# Altium schematic sheet DRV8701ESheet.SchDoc
size 304 x 215 mm; SheetNumber: 1; SheetTotal: 1
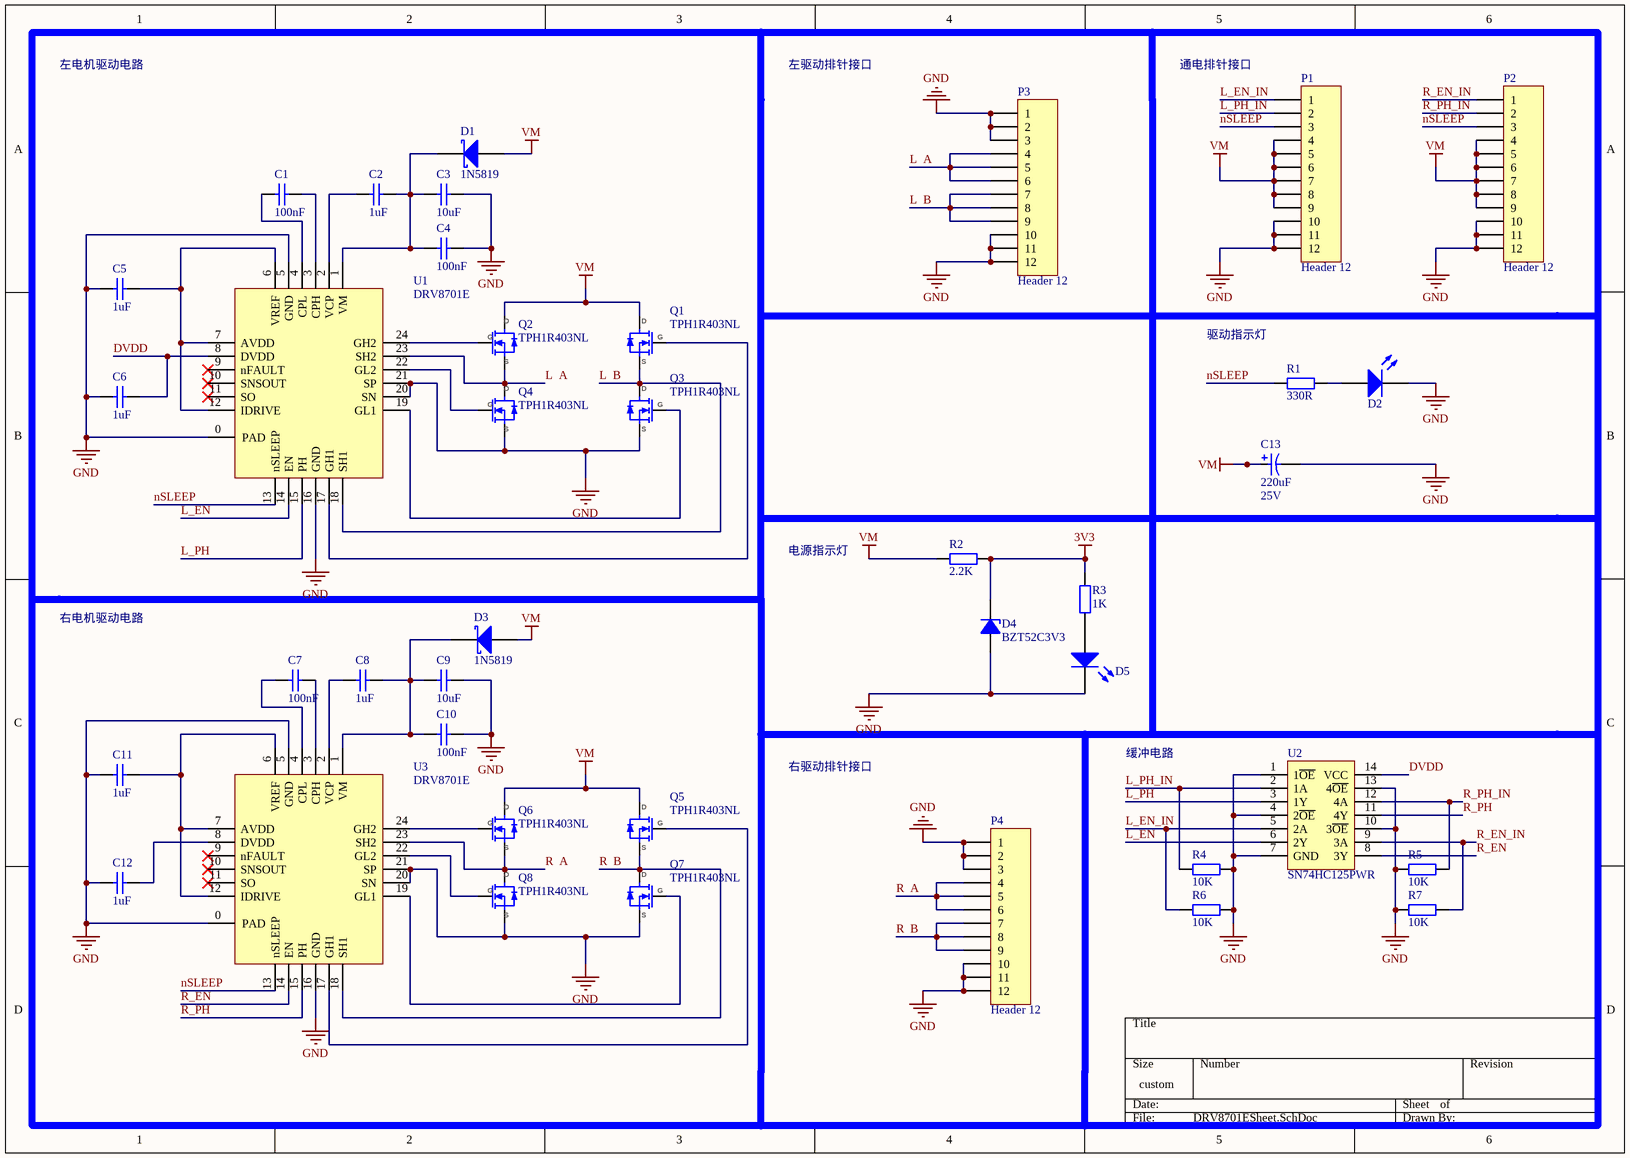
[diagram p0: DRV8701ESheet.SchDoc]

## Parts
C1  100nF  [C0603_L]
C2  1uF  [C0603_L]
C3  10uF  [C0603_L]
C4  100nF  [C0603_L]
C5  1uF  [C0603_L]
C6  1uF  [C0603_L]
C7  100nF  [C0603_L]
C8  1uF  [C0603_L]
C9  10uF  [C0603_L]
C10  100nF  [C0603_L]
C11  1uF  [C0603_L]
C12  1uF  [C0603_L]
C13  value 220uF  Voltage: 25V  [CAPPR3.5-8X11.5]  (hidden comment: 220uF 25V)
D1  1N5819  [SOD-323]
D2  LED  [LED-0603_R]  (value not drawn)
D3  1N5819  [SOD-323]
D4  BZT52C3V3  [SOD-123-L]
D5  LED  [LED-0603_R]  (value not drawn)
P1  Header 12  [HDR1X12]
P2  Header 12  [HDR1X12]
P3  Header 12  [HDR1X12]
P4  Header 12  [HDR1X12]
Q1  TPH1R403NL  [DFN5x6]
Q2  TPH1R403NL  [DFN5x6]
Q3  TPH1R403NL  [DFN5x6]
Q4  TPH1R403NL  [DFN5x6]
Q5  TPH1R403NL  [DFN5x6]
Q6  TPH1R403NL  [DFN5x6]
Q7  TPH1R403NL  [DFN5x6]
Q8  TPH1R403NL  [DFN5x6]
R1  330R  [R0603_L]
R2  2.2K  [R0603_L]
R3  1K  [R0603_L]
R4  10K  [R0603_L]
R5  10K  [R0603_L]
R6  10K  [R0603_L]
R7  10K  [R0603_L]
U1  DRV8701E  [QFN24-4x4]
U2  SN74HC125PWR  [TSSOP14]
U3  DRV8701E  [QFN24-4x4]

## Nets
3V3: D4.K R2.2 R3.2
GND: C3.2 C4.2 C5.1 C6.1 C9.2 C10.2 C11.1 C12.1 C13.2 D2.2(K) D4.A D5.2(K) P1.10 P1.11 P1.12 P2.10 P2.11 P2.12 P3.1 P3.2 P3.3 P3.10 P3.11 P3.12 P4.1 P4.2 P4.3 P4.10 P4.11 P4.12 Q3.3(S) Q4.3(S) Q7.3(S) Q8.3(S) R4.2 R5.1 R6.2 R7.1 U1.0(PAD) U1.5(GND) U1.16(GND) U1.20(SN) U1.21(SP) U2.1(1~{OE}) U2.4(2~{OE}) U2.7(GND) U2.10(3~{OE}) U2.13(4~{OE}) U3.0(PAD) U3.5(GND) U3.16(GND) U3.20(SN) U3.21(SP)
VM: C13.1 D1.1(A) D3.1(A) P1.4 P1.5 P1.6 P1.7 P1.8 P1.9 P2.4 P2.5 P2.6 P2.7 P2.8 P2.9 Q1.1(D) Q2.1(D) Q5.1(D) Q6.1(D) R2.1
DVDD: C6.2 U1.8(DVDD) U2.14(VCC)
L  A: P3.4 P3.5 P3.6 Q2.3(S) Q4.1(D) U1.23(SH2)
L  B: P3.7 P3.8 P3.9 Q1.3(S) Q3.1(D) U1.18(SH1)
L_EN: U1.14(EN) U2.6(2Y)
L_EN_IN: P1.1 R6.1 U2.5(2A)
L_PH: U1.15(PH) U2.3(1Y)
L_PH_IN: P1.2 R4.1 U2.2(1A)
nSLEEP: P1.3 P2.3 R1.1 U1.13(nSLEEP) U3.13(nSLEEP)
R  A: P4.4 P4.5 P4.6 Q6.3(S) Q8.1(D) U3.23(SH2)
R  B: P4.7 P4.8 P4.9 Q5.3(S) Q7.1(D) U3.18(SH1)
R_EN: U2.8(3Y) U3.14(EN)
R_EN_IN: P2.1 R7.2 U2.9(3A)
R_PH: U2.11(4Y) U3.15(PH)
R_PH_IN: P2.2 R5.2 U2.12(4A)
NetC1_1: C1.1 U1.4(CPL)
NetC1_2: C1.2 U1.3(CPH)
NetC2_1: C2.1 U1.2(VCP)
NetC2_2: C2.2 C3.1 C4.1 D1.2(K) U1.1(VM)
NetC5_2: C5.2 U1.6(VREF) U1.7(AVDD) U1.12(IDRIVE)
NetC7_1: C7.1 U3.4(CPL)
NetC7_2: C7.2 U3.3(CPH)
NetC8_1: C8.1 U3.2(VCP)
NetC8_2: C8.2 C9.1 C10.1 D3.2(K) U3.1(VM)
NetC11_2: C11.2 U3.6(VREF) U3.7(AVDD) U3.12(IDRIVE)
NetC12_2: C12.2 U3.8(DVDD)
NetD2_1: D2.1(A) R1.2
NetD5_1: D5.1(A) R3.1
NetQ1_2: Q1.2(G) U1.17(GH1)
NetQ2_2: Q2.2(G) U1.24(GH2)
NetQ3_2: Q3.2(G) U1.19(GL1)
NetQ4_2: Q4.2(G) U1.22(GL2)
NetQ5_2: Q5.2(G) U3.17(GH1)
NetQ6_2: Q6.2(G) U3.24(GH2)
NetQ7_2: Q7.2(G) U3.19(GL1)
NetQ8_2: Q8.2(G) U3.22(GL2)

Not connected (* = marked no-connect by the designer): U1 9(nFAULT)* 10(SNSOUT)* 11(SO)*; U3 9(nFAULT)* 10(SNSOUT)* 11(SO)*

## Notes on the sheet
- 左电机驱动电路
- 左驱动排针接口
- 通电排针接口
- 驱动指示灯
- 电源指示灯
- 右电机驱动电路
- 右驱动排针接口
- 缓冲电路

## Library data of the parts
C1-C12 = C-SMD: 贴片电容; BOM名称: 无极性贴片电容
C13 = Cap-Elect: Polarized Capacitor (Radial); Published: 8-Jun-2000; Revision: July-2002: Re-released for DXP Platform.; Publisher: Altium Limited; Price(RMB): 0.000
D1 D3 = 1N5819: 肖特基二极管; BOM名称: 肖特基二极管
D2 D5 = LED_SMD: 贴片发光二极管
D4 = Diode Zen: 3.3V稳压二极管; Published: 8-Jun-2000; Revision: July-2002: Re-released for DXP Platform.; Publisher: Altium Limited; Price(RMB): 0.000
P1-P4 = Header 12: Header, 12-Pin; LatestRevisionDate: 17-Jul-2002; LatestRevisionNote: Re-released for DXP Platform.; Publisher: Altium Limited
Q1-Q8 = TPH1R403NL: N沟道MOS
R1-R7 = R-SMD: 贴片电阻; BOM名称: 贴片电阻
U1 U3 = DRV8701E: DRV8701E Ti全桥驱动芯片
U2 = SN74HC125PWR: 三态输出的四路缓冲器